# Altium schematic sheet SchaltmichAus.SchDoc
size A3; SheetNumber: 1; SheetTotal: 1
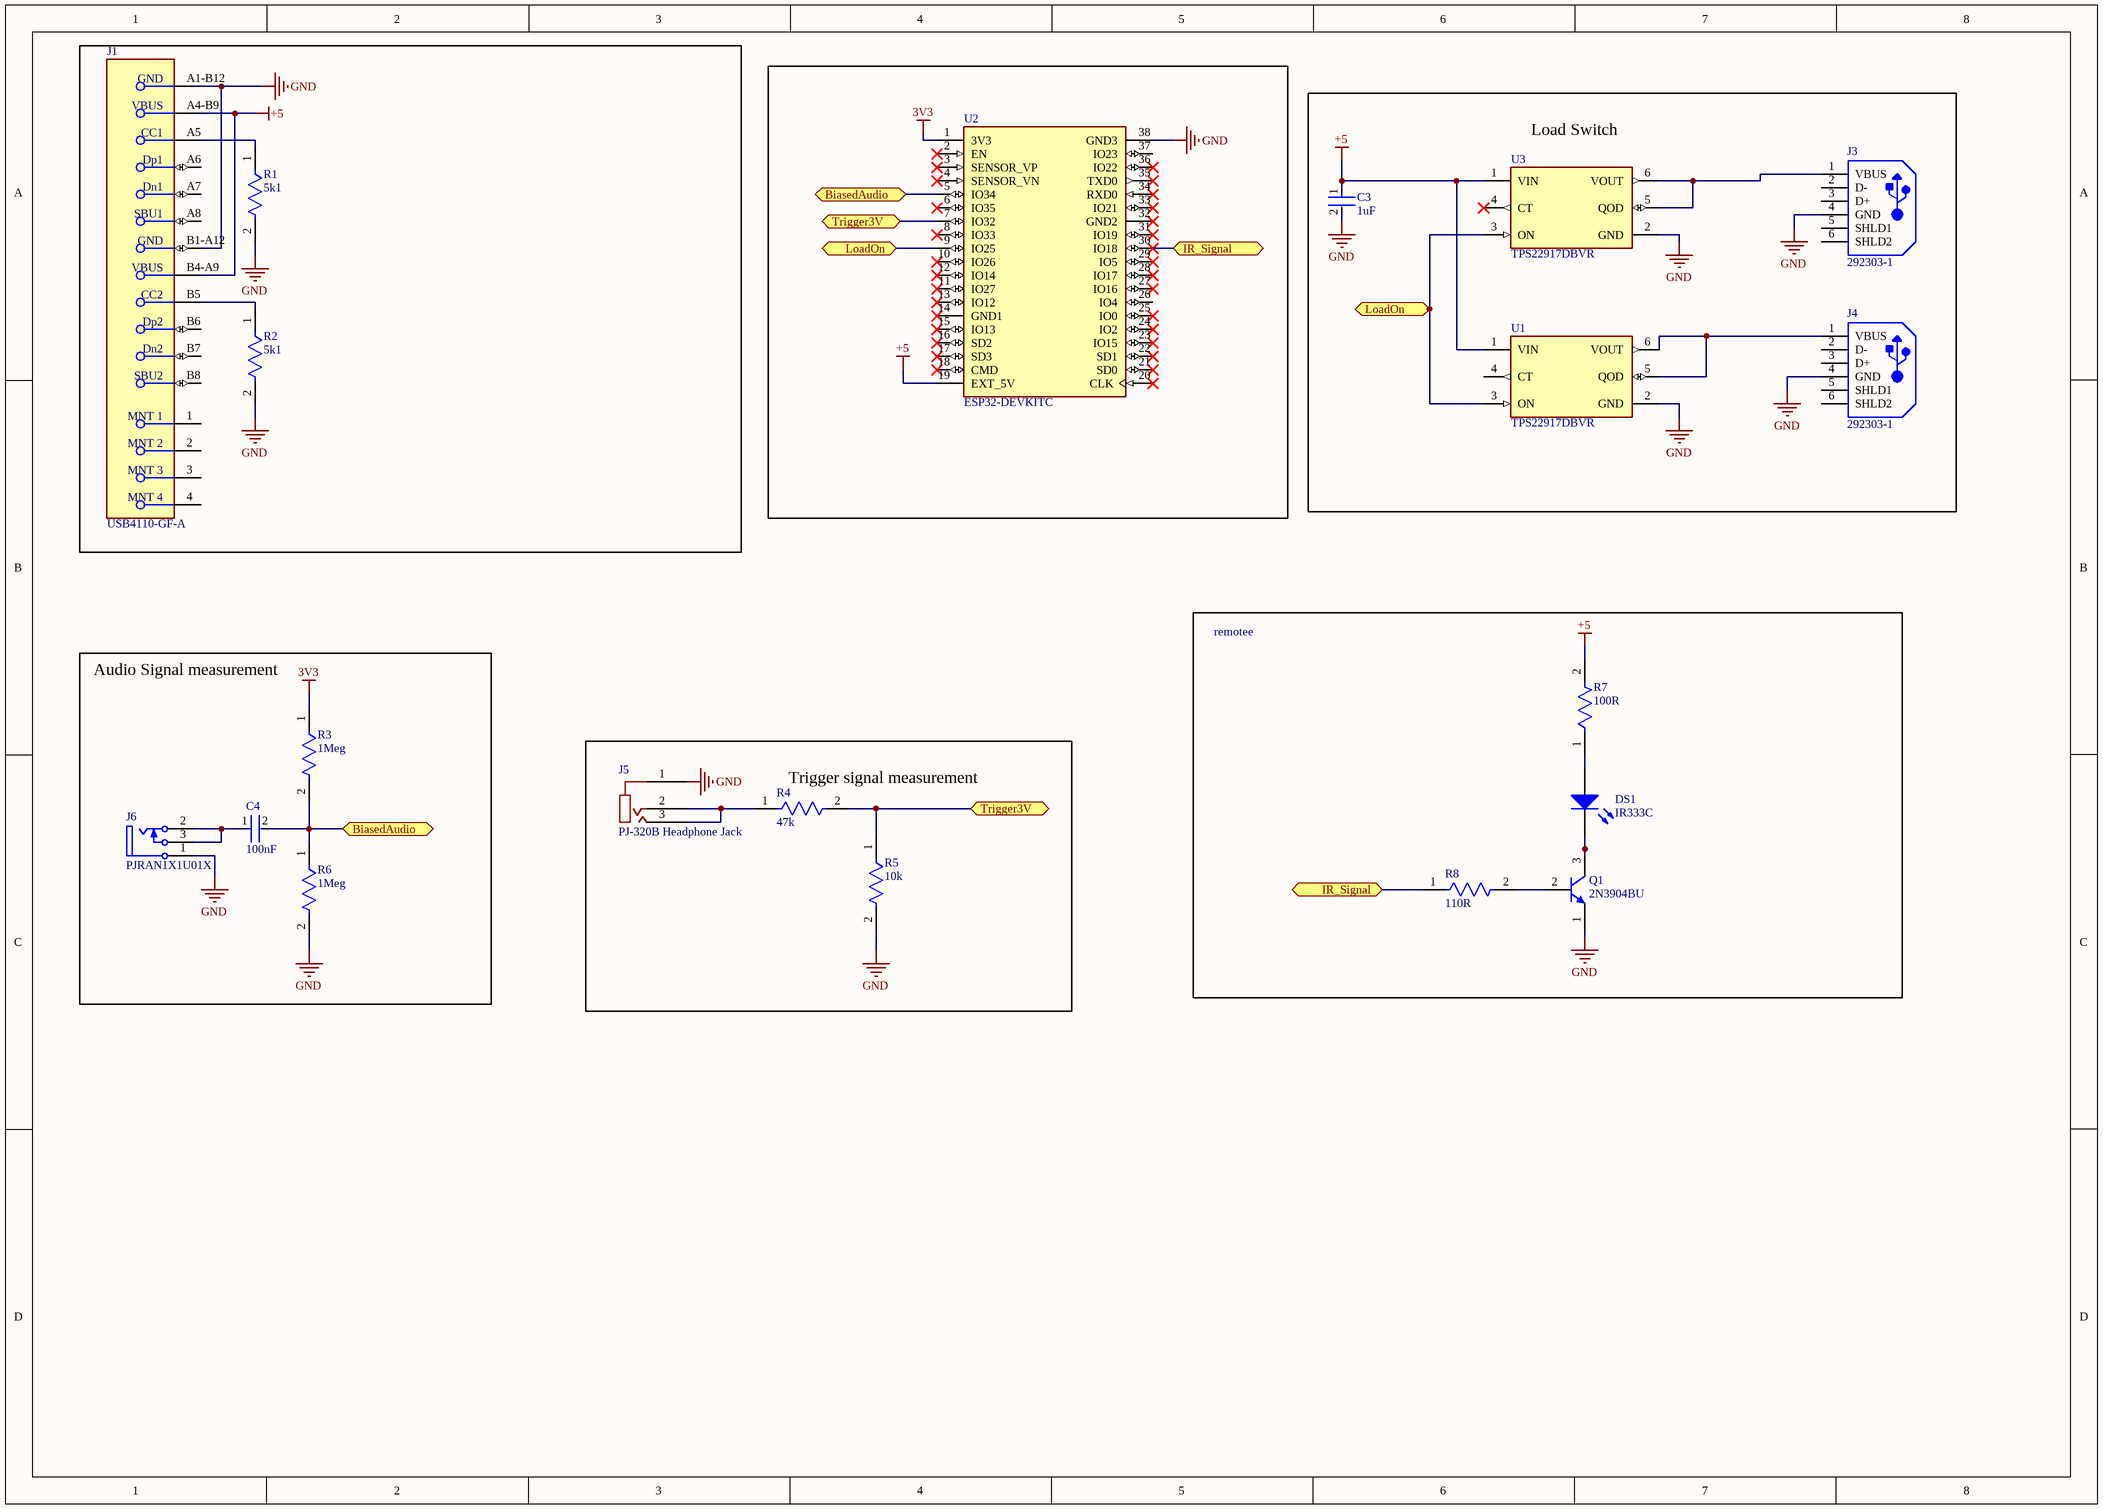
[diagram p0: SchaltmichAus.SchDoc]

## Parts
C3  1uF  [FP-CC1206-FD-MFG]
C4  100nF  [FP-CC1206-FD-MFG]
DS1  IR333C  [EVRL-IR333C]
J1  USB4110-GF-A  [FP-USB4110-GF-A-MFG]
J3  292303-1  [TE-292303-1_V]
J4  292303-1  [TE-292303-1_V]
J5  PJ-320B Headphone Jack  [New footprint 1]
J6  PJRAN1X1U01X  [SWIT-PJRAN1X1U01X_V]
Q1  2N3904BU  [FAIR-TO-92]
R1  5k1  [FP-CRGP1206-IPC_C]
R2  5k1  [FP-CRGP1206-IPC_C]
R3  1Meg  [FP-CRGP1206-IPC_C]
R4  47k  [FP-CRGP1206-IPC_C]
R5  10k  [FP-CRGP1206-IPC_C]
R6  1Meg  [FP-CRGP1206-IPC_C]
R7  100R  [FP-CRGP1206-IPC_C]
R8  110R  [FP-CRGP1206-IPC_C]
U1  TPS22917DBVR  [FP-DBV0006A-IPC_A]
U2  ESP32-DEVKITC  [MODULE_ESP32-DEVKITC]
U3  TPS22917DBVR  [FP-DBV0006A-IPC_A]

## Blocks framed on the sheet
Load Switch: C3 J3 J4 U1 U3
Audio Signal measurement: C4 J6 R3 R6
remotee: DS1 Q1 R7 R8
Trigger signal measurement: J5 R4 R5

## Ports
BiasedAudio (bidir, see SchaltmichAus[2C]), BiasedAudio (bidir, see SchaltmichAus[4A]), IR_Signal (bidir, see SchaltmichAus[5A]), IR_Signal (bidir, see SchaltmichAus[5C]), LoadOn (bidir, see SchaltmichAus[4A]), LoadOn (bidir, see SchaltmichAus[6A]), Trigger3V (bidir, see SchaltmichAus[4A]), Trigger3V (bidir, see SchaltmichAus[4C])

## Nets
3V3: R3.1 U2.1(3V3)
+5: C3.1 J1.A4-B9(VBUS) J1.B4-A9(VBUS) R7.2 U1.1(VIN) U2.19(EXT_5V) U3.1(VIN)
GND: C3.2 J1.A1-B12(GND) J1.B1-A12(GND) J3.4(GND) J4.4(GND) J5.1 J6.1(SLEEVE) Q1.1(E) R1.2 R2.2 R5.2 R6.2 U1.2(GND) U2.38(GND3) U3.2(GND)
BiasedAudio: C4.2 R3.2 R6.1 U2.5(IO34) ; port BiasedAudio
IR_Signal: R8.1 U2.30(IO18) ; port IR_Signal
LoadOn: U1.3(ON) U2.9(IO25) U3.3(ON) ; port LoadOn
Trigger3V: R4.2 R5.1 U2.7(IO32) ; port Trigger3V
NetC4_1: C4.1 J6.2(TIP) J6.3(SHUNT)
NetDS1_1: DS1.1(A) R7.1
NetDS1_2: DS1.2(K) Q1.3(C)
NetJ1_A5: J1.A5(CC1) R1.1
NetJ1_B5: J1.B5(CC2) R2.1
NetJ3_1: J3.1(VBUS) U3.5(QOD) U3.6(VOUT)
NetJ4_1: J4.1(VBUS) U1.5(QOD) U1.6(VOUT)
NetJ5_2: J5.2 J5.3 R4.1
NetQ1_2: Q1.2(B) R8.2

Not connected (* = marked no-connect by the designer): J1 1(MNT_1) 2(MNT_2) 3(MNT_3) 4(MNT_4) A6(Dp1) A7(Dn1) A8(SBU1) B6(Dp2) B7(Dn2) B8(SBU2); J3 2(D-) 3(D+) 5(SHLD1) 6(SHLD2); J4 2(D-) 3(D+) 5(SHLD1) 6(SHLD2); U1 4(CT); U2 2(EN)* 3(SENSOR_VP)* 4(SENSOR_VN)* 6(IO35)* 8(IO33)* 10(IO26)* 11(IO27)* 12(IO14)* 13(IO12)* 14(GND1)* 15(IO13)* 16(SD2)* 17(SD3)* 18(CMD)* 20(CLK)* 21(SD0)* 22(SD1)* 23(IO15)* 24(IO2)* 25(IO0)* 26(IO4) 27(IO16)* 28(IO17)* 29(IO5)* 31(IO19)* 32(GND2)* 33(IO21)* 34(RXD0)* 35(TXD0)* 36(IO22)* 37(IO23); U3 4(CT)*

## Library data of the parts
C3 C4 = CMP-03422-001420-1: CAP CER 10UF 50V X5R 1206; Tolerance: 10%; Voltage Rating (DC): 50V; Width: 0.063inch; Halogen Free: Halogen Free; Mount: Surface Mount; Dielectric: X5R; Max Operating Temperature: 85°C; Capacitance: 10uF; Case/Package: 1206; Voltage Rating: 50V; Lead Free: Lead Free; Thickness: 0.075inch; Min Operating Temperature: -55°C; Length: 0.126inch; Packaging: Tape and Reel; RoHS Compliant: Yes
DS1 = CMP-2000-05108-1: Infrared LED, 1.2 V, -40 to 85 degC, 2-Pin Radial, RoHS, Bulk; Manufacturer: Everlight Electronics; Viewing Angle: 40deg; Power Rating: 150mW; Maximum Forward Current: 1A; Brand: Everlight; Operating Voltage: 1.2V; Wavelength: 940nm; Radiant Intensity: 12mW/sr; Lens Shape: Dome; Forward Current: 20mA; Datasheet URL: http://www.everlight.com/file/ProductFile/201407061521223111.pdf; Manufacturer URL: http://www.everlight.com/; Mounting Style: ThroughHole; Factory Pack Quantity: 500; RoHS: Details; Illumination Color: Infrared; Package / Case: T-13/4; Forward Voltage: 1.2V; Minimum Operating Temperature: -40C; Product Category: InfraredEmitters; Datasheet Version: May-13; Maximum Operating Temperature: +85C
J1 = CMP-245163-000002-1: CONN USB 2.0 TYPE-C R/A SMT; Manufacturer: GCT; Conn Orientation: Right Angle; Usb Standard: USB 2.0; Voltage Rating: 20V; Current Rating: 3/4.25/1.25/0.25A; Number Of Contacts: 16; Is Female: yes; Shielding: true; Standoff Height: 0.1mm; Octopart: https://octopart.com/usb4110-gf-a-gct-103941985; Temperature: -40°C to +85°C; RoHS: TRUE; Automotive: No; Contact Material: Gold,Nickel; Device Class L1: Connectors; Device Class L2: USB Connectors; Package: 0; Lead Free: Yes; ComponentLink2URL: https://gct.co/files/drawings/usb4110.pdf; Temperature Range High: +85°C; Temperature Range Low: -40°C; Height: 3.46mm; Manufacturer Part Number: USB4110-GF-A; ComponentLink2Description: Datasheet; Device Class L3: unset; Digikey Description: CONN USB 2.0 TYPE-C R/A SMT; Category: Conn
J3 J4 = CMP-2000-05404-1: 1 Port Right Angle Through Hole Mount Female Type A USB Connector, 4 Position, -55 to 85 degC, RoHS, Tube; Manufacturer: TE Connectivity; Contact Termination Type: Solder; No. of Contacts: 4; Connector Mounting: PCB; SVHC: NoSVHC(16-Jun-2014); Gender: Receptacle; Connector Type: USBA; Package Description: 4-Pin Through Hole Device, Body 14 x 13.13 mm, Pitch 2.5 mm; Contact Plating: Gold; Package Reference: 292303-1; Contact Material: Copper; Datasheet URL: http://www.farnell.com/cad/1653030.pdf; Datasheet Version: Feb-12; Manufacturer URL: http://www.te.com/
J5 = CMP-002-00071-2: 200mA 3.5mm Headphone Jack 30V SMD Audio Connectors ROHS
J6 = CMP-1772-00003-1: Female Phono Jack, 3 Position, Height 13 mm, Tail Length 4 mm, RoHS, Bulk; Case\Package: Radial; Type (Capacitors): X7R; Tolerance: 10%; Voltage Rating (DC): 50 V; Capacitance: 100 nF; Package Quantity: 500; Mount: Through Hole; Packaging: Bulk; Height: 3.18 mm; Min Operating Temperature: -55 degC; Radiation Hardening: No; PackageDescription: Female Phono Jack, 3 Position, Height 13 mm, Tail Length 4 mm; Length: 6.6 mm; Lead Pitch: 2.54 mm; Width: 5.08 mm; REACH SVHC: No SVHC; ComponentLink1Description: Manufacturer URL; Max Operating Temperature: 125 degC; ComponentLink2Description: Datasheet; DatasheetVersion: Rev. A, 01/2006; Voltage Rating: 50 V; ComponentLink2URL: http://www.conxall.com/Drawings/pjran1x1u__x_series_cd.pdf; ComponentLink1URL: http://www.switchcraft.com/; RoHSCompliant: true; Pins: 2; PackageReference: PJRAN1X1U01X
Q1 = CMP-2000-04944-1: NPN General-Purpose Amplifier, 40 V VCEO, 0.2 A, -55 to 150 degC, 2-Pin TO-92, RoHS, Bulk; Manufacturer: FairchildSemiconductor; Maximum Collector Base Voltage: 60V; Minimum DC Current Gain: 40@0.1mA@1V; Maximum Collector Emitter Voltage: 40V; Maximum DC Collector Current: 0.2A; Rad Hard: No; Maximum Operating Frequency: 300(Min)MHz; Maximum Collector Emitter Saturation Voltage: 0.2@1mA@10mA; Maximum Power Dissipation: 625mW; Package Description: 3-Pin Transistor Outline Package, Body Dia 4.79 mm, Pitch 1.27 mm; Package Reference: TO-92; Pin Count: 3; Operating Temperature: -55to150degC; Category: GPBJT; Manufacturer URL: https://www.fairchildsemi.com/; Datasheet URL: https://datasheet.ciiva.com/4722/2n3904-82270-4722369.pdf; Package: 3TO-92; Packaging: Bulk; Type: NPN; Datasheet Version: Rev. 1.1.0, 10/2014; Mounting: ThroughHole
R1-R8 = CMP-03211-001403-1: CRGP1206 100KΩ 0.5W ±100ppm/°C 1% 200V; Manufacturer: TE; Manufacturer Part Number: CRGP1206F100K; Tolerance: 0.01; Power Rating: 0.5W; Ipc Land Pattern Name: RESC310155X55; Series: CRGP; Temperature Range Low: -55°C; Temperature Range High: +155°C; Temperature Coefficient: ±100ppm/°C; Temperature: -55°C to +155°C; Voltage Rating: 200V; Ambient Temperature Range High: +70°C; Height: 0.65mm; Automotive: No; Device Class L3: Chip SMD Resistors; ComponentLink2URL: https://www.mouser.com/datasheet/2/418/NG_DS_9-1773463-9_A-1358566.pdf; Composition: Thick Film; Category: Res; Resistance: 100KΩ; ComponentLink2Description: Datasheet; Package: CRGP1206; Value: 100KΩ; Lead Free: Yes; RoHS: TRUE; Device Class L2: Resistors; Device Class L1: Passive Components; Octopart: https://octopart.com/crgp1206f100k-te+connectivity-91018841
U1 U3 = CMP-04912-000029-1: IC PWR SWITCH P-CHAN 1:1 SOT23-6; Number of Outputs: 1; Output Configuration: High Side; Fault Protection: Reverse Current; Interface: On/Off; Max Output Current: 2A; Max Operating Temperature: 125°C; Case/Package: SOT-23-6; Packaging: Tape and Reel; Number of Channels: 1; Min Operating Temperature: -40°C
U2 = CMP-003-000000-1: ESP32-WROOM-32UE series Transceiver; 802.11 b/g/n (Wi-Fi, WiFi, WLAN), Bluetooth Â® Smart Ready 4.x Dual Mode Evaluation Board; MF: Espressif Systems; MP: ESP32-DEVKITC; Check_prices: https://www.snapeda.com/parts/ESP32-DEVKITC/Espressif+Systems/view-part/?ref=eda; SnapEDA_Link: https://www.snapeda.com/parts/ESP32-DEVKITC/Espressif+Systems/view-part/?ref=snap; Design Item ID: ESP32-DEVKITC; Component Type: Standard; Package: None; Value: *; Pin Count: 38; Source: ESP32-DEVKITC.SchLib